# EAGLE design main (EAGLE 6.6.0)
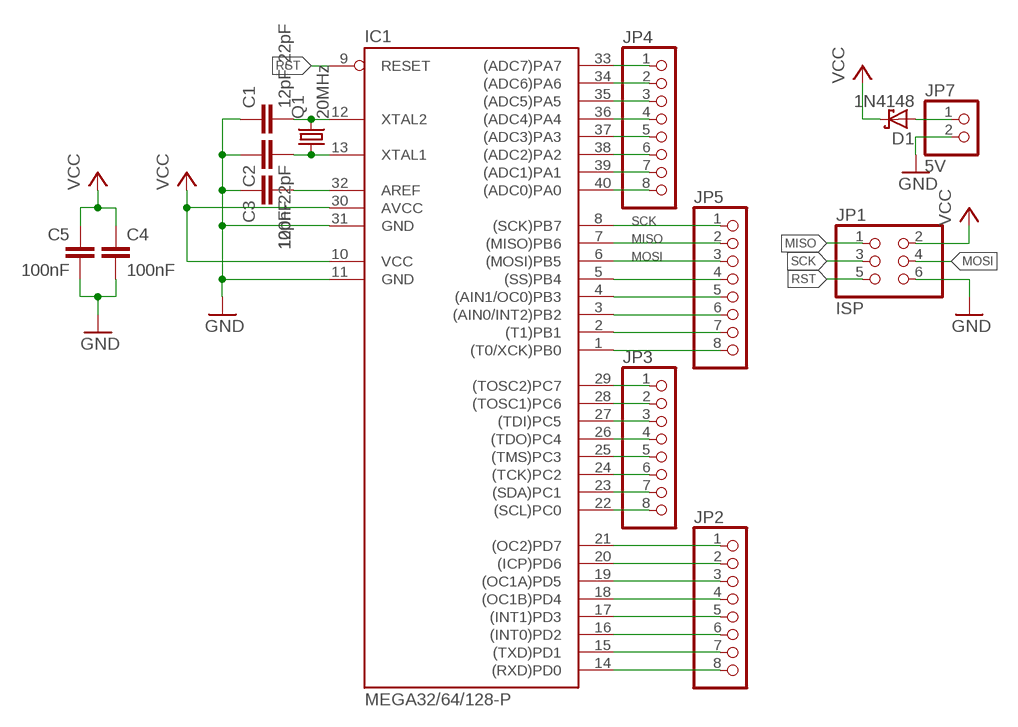
[diagram p0: schematic, sheet 1]

## Parts
C1  12pF-22pF  C-EUC0805K  [C0805K]
C2  12pF-22pF  C-EUC0805K  [C0805K]
C3  100nF  C-EUC0805K  [C0805K]
C4  100nF  C-EUC0805K  [C0805K]
C5  100nF  C-EUC0805K  [C0805K]
D1  1N4148  1N5817-B  [DO41-7.6]
IC1  MEGA32/64/128-P  MEGA32-P  [DIL40]
JP1  ISP  PINHD-2X3  [2X03]
JP2  PINHD-1X8  [1X08]
JP3  PINHD-1X8  [1X08]
JP4  PINHD-1X8  [1X08]
JP5  PINHD-1X8  [1X08]
JP7  5V  PINHD-1X2  [1X02]
Q1  20MHz  CSM-7X-DU  [CSM-7X-DU]

## Nets
GND: C1.1 C2.1 C3.1 C4.2 C5.2 IC1.11(GND) IC1.31(GND) JP1.6 JP7.2
MISO: IC1.7((MISO)PB6) JP1.1 JP5.2
MOSI: IC1.6((MOSI)PB5) JP1.4 JP5.3
N$1: C2.2 IC1.13(XTAL1) Q1.1
N$2: C1.2 IC1.12(XTAL2) Q1.2
N$3: D1.A JP7.1
N$4: C3.2 IC1.32(AREF)
N$5: IC1.5((SS)PB4) JP5.4
N$6: IC1.4((AIN1/OC0)PB3) JP5.5
N$7: IC1.21((OC2)PD7) JP2.1
N$8: IC1.20((ICP)PD6) JP2.2
N$9: IC1.19((OC1A)PD5) JP2.3
N$10: IC1.18((OC1B)PD4) JP2.4
N$11: IC1.17((INT1)PD3) JP2.5
N$12: IC1.16((INT0)PD2) JP2.6
N$13: IC1.15((TXD)PD1) JP2.7
N$14: IC1.14((RXD)PD0) JP2.8
N$15: IC1.29((TOSC2)PC7) JP3.1
N$16: IC1.28((TOSC1)PC6) JP3.2
N$17: IC1.27((TDI)PC5) JP3.3
N$18: IC1.26((TDO)PC4) JP3.4
N$19: IC1.25((TMS)PC3) JP3.5
N$20: IC1.24((TCK)PC2) JP3.6
N$21: IC1.23((SDA)PC1) JP3.7
N$22: IC1.22((SCL)PC0) JP3.8
N$23: IC1.33((ADC7)PA7) JP4.1
N$24: IC1.34((ADC6)PA6) JP4.2
N$25: IC1.35((ADC5)PA5) JP4.3
N$26: IC1.36((ADC4)PA4) JP4.4
N$27: IC1.37((ADC3)PA3) JP4.5
N$28: IC1.38((ADC2)PA2) JP4.6
N$29: IC1.39((ADC1)PA1) JP4.7
N$30: IC1.40((ADC0)PA0) JP4.8
N$31: IC1.3((AIN0/INT2)PB2) JP5.6
N$32: IC1.2((T1)PB1) JP5.7
N$33: IC1.1((T0/XCK)PB0) JP5.8
RST: IC1.9(RESET) JP1.5
SCK: IC1.8((SCK)PB7) JP1.3 JP5.1
VCC: C4.1 C5.1 D1.C IC1.10(VCC) IC1.30(AVCC) JP1.2

## Library data of the parts
C1-C5 = rcl:C-EU: CAPACITOR, European symbol
D1 = diode:1N581*: 1.0A SCHOTTKY BARRIER RECTIFIER Source: http://www.diodes.com/datasheets/ds23001.pdf
IC1 = atmel:MEGA32-P: MICROCONTROLLER 32 Kbytes FLASH 2 Kbytes SRAM 1 Kbytes EEPROM USART 8-channel 10 bit ADC Source: www.atmel.com .. doc2503.pdf; MPN: ATMEGA32-16PU; OC_FARNELL: 1661729; OC_NEWARK: 51P1794
JP1 = pinhead:PINHD-2X3: PIN HEADER
JP2-JP5 = pinhead:PINHD-1X8: PIN HEADER
JP7 = pinhead:PINHD-1X2: PIN HEADER
Q1 = crystal:CSM-7X-DU: SMD CRYSTAL Source: www.ecsxtal.com .. Crystal 3.6864MHz CSM_7X_DU.PDF; OC_FARNELL: unknown; OC_NEWARK: unknown

## Board
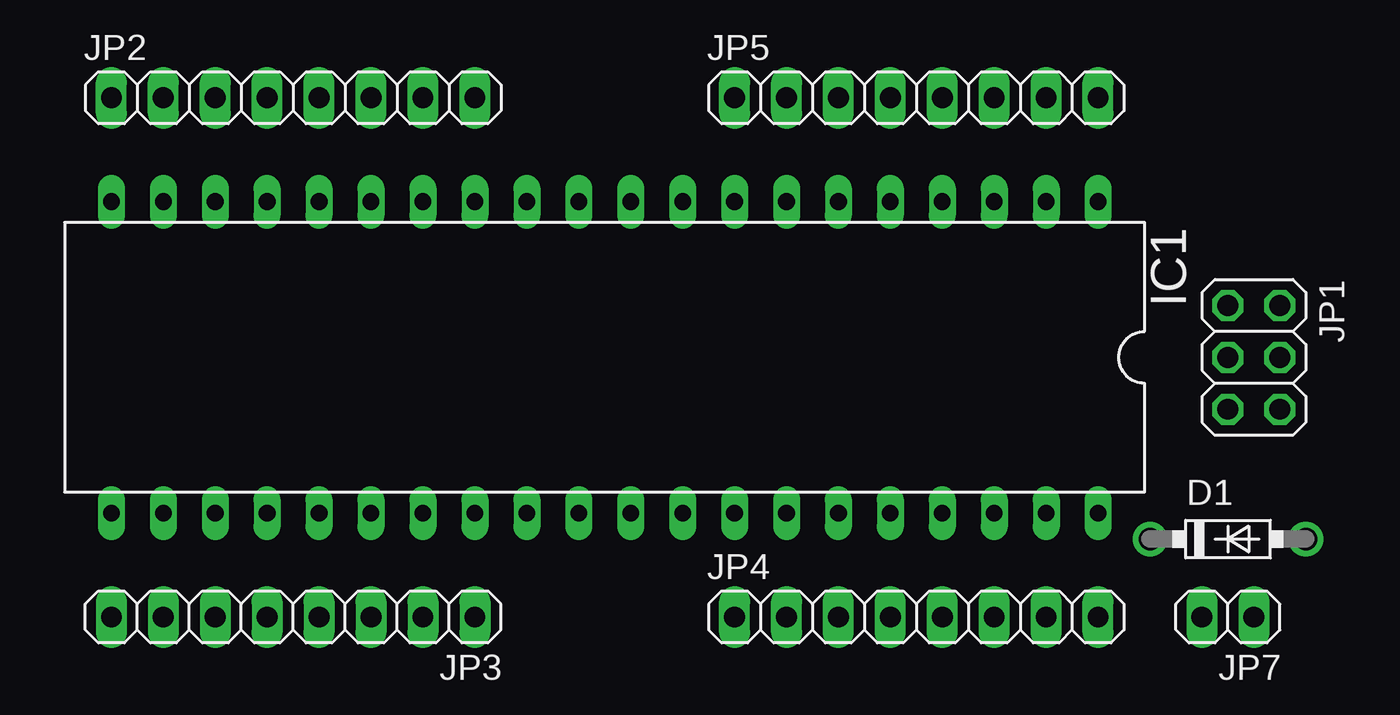
[diagram p1: board, top side]
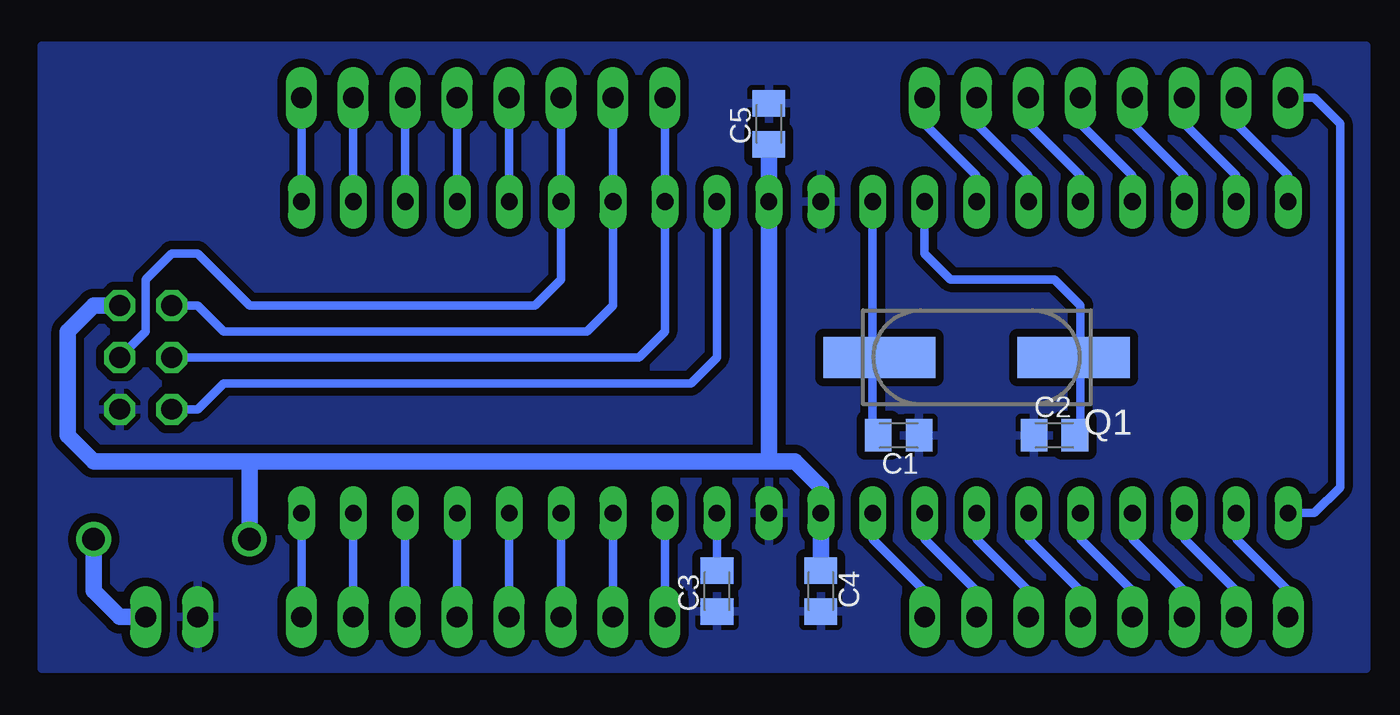
[diagram p2: board, bottom side, seen from below]

No outline drawn. Coordinates in mm, seen from the top.
Copper layers (1*16): Top 0.035mm / dielectric 1.5mm / Bottom 0.035mm
Design rules "default": minimum track width 10mil, minimum drill 24mil, track to track 8mil, track to pad 8mil, pad to pad 8mil, via to via 8mil, smd to smd 8mil, copper to edge 40mil, drill to drill 8mil, minimum pad ring 10mil, minimum via ring 8mil, stop-mask expansion 4mil, vias tented up to drill 0mil, thermal gap 10mil

### Footprints (pad centres in the part's own frame; a part is rotated, then mirrored left to right if it is on the bottom)
C0805K = smd 1.3 x 1.6: 1 -1,0; 2 1,0
DO41-7.6 = drill 1.1 pad 1.7: A 3.81,0; C -3.81,0
DIL40 = drill 0.813 long: 1 -24.13,-7.62; 2 -21.59,-7.62; 3 -19.05,-7.62; 4 -16.51,-7.62; 5 -13.97,-7.62; 6 -11.43,-7.62; 7 -8.89,-7.62; 8 -6.35,-7.62; 9 -3.81,-7.62; 10 -1.27,-7.62; 11 1.27,-7.62; 12 3.81,-7.62; 13 6.35,-7.62; 14 8.89,-7.62; 15 11.43,-7.62; 16 13.97,-7.62; 17 16.51,-7.62; 18 19.05,-7.62; 19 21.59,-7.62; 20 24.13,-7.62; 21 24.13,7.62; 22 21.59,7.62; 23 19.05,7.62; 24 16.51,7.62; 25 13.97,7.62; 26 11.43,7.62; 27 8.89,7.62; 28 6.35,7.62; 29 3.81,7.62; 30 1.27,7.62; 31 -1.27,7.62; 32 -3.81,7.62; 33 -6.35,7.62; 34 -8.89,7.62; 35 -11.43,7.62; 36 -13.97,7.62; 37 -16.51,7.62; 38 -19.05,7.62; 39 -21.59,7.62; 40 -24.13,7.62
2X03 = drill 1.016 octagon: 1 -2.54,-1.27; 2 -2.54,1.27; 3 0,-1.27; 4 0,1.27; 5 2.54,-1.27; 6 2.54,1.27
1X08 = drill 1.016 long: 1 -8.89,0; 2 -6.35,0; 3 -3.81,0; 4 -1.27,0; 5 1.27,0; 6 3.81,0; 7 6.35,0; 8 8.89,0
1X02 = drill 1.016 long: 1 -1.27,0; 2 1.27,0
CSM-7X-DU = smd 5.5 x 2: 1 -4.75,0; 2 4.75,0

### Placement (x,y rotation side)
C1  22.86,11.43 180 bottom
C2  15.24,11.43 0 bottom
C3  31.75,3.81 90 bottom
C4  26.67,3.81 270 bottom
C5  29.21,26.67 90 bottom
D1  58.42,6.35 0 top
IC1  27.94,15.24 180 top
JP1  59.69,15.24 270 top
JP2  12.7,27.94 0 top
JP3  12.7,2.54 180 top
JP4  43.18,2.54 0 top
JP5  43.18,27.94 0 top
JP7  58.42,2.54 180 top
Q1  19.05,15.24 180 bottom

### Tracks (layer width: path | path; a pad name or v marks a point on that pad's centre or on a via)
GND
  Bottom 0.406: 31.48,2.54 C3.1
  pour Bottom (isolate 0.406): 0,0 64.77,0 64.77,30.48 0,30.48
MISO
  Bottom 0.406: JP1.1 57.15,17.78 55.88,16.51 38.1,16.51 36.83,17.78 IC1.7 JP5.2
MOSI
  Bottom 0.406: JP1.4 59.69,16.51 59.69,19.05 58.42,20.32 57.15,20.32 54.61,17.78 40.64,17.78 39.37,19.05 IC1.6 JP5.3
N$1
  Bottom 0.406: IC1.13 21.59,20.32 20.32,19.05 15.24,19.05 13.97,17.78 13.97,15.24 | Q1.1 13.97,15.24 | C2.2 13.97,11.43 13.97,15.24
N$2
  Bottom 0.406: C1.2 24.13,11.43 24.13,15.24 Q1.2 24.13,15.57 IC1.12
N$3
  Bottom 0.813: JP7.1 60.96,2.54 62.23,3.81 D1.A
N$4
  Bottom 0.406: IC1.32 C3.2
N$5
  Bottom 0.406: IC1.5 JP5.4
N$6
  Bottom 0.406: JP5.5 IC1.4
N$7
  Bottom 0.406: JP2.1 2.54,27.94 1.27,26.67 1.27,8.89 2.54,7.62 IC1.21
N$8
  Bottom 0.406: JP2.2 6.35,26.67 3.81,24.13 IC1.20
N$9
  Bottom 0.406: JP2.3 8.89,26.67 6.35,24.13 IC1.19
N$10
  Bottom 0.406: JP2.4 11.43,26.67 8.89,24.13 IC1.18
N$11
  Bottom 0.406: JP2.5 13.97,26.67 11.43,24.13 IC1.17
N$12
  Bottom 0.406: IC1.16 13.97,24.13 16.51,26.67 JP2.6
N$13
  Bottom 0.406: IC1.15 16.51,24.13 19.05,26.67 JP2.7
N$14
  Bottom 0.406: IC1.14 19.05,24.13 21.59,26.67 JP2.8
N$15
  Bottom 0.406: IC1.29 24.13,6.35 21.59,3.81 JP3.1
N$16
  Bottom 0.406: IC1.28 21.59,6.35 19.05,3.81 JP3.2
N$17
  Bottom 0.406: IC1.27 19.05,6.35 16.51,3.81 JP3.3
N$18
  Bottom 0.406: IC1.26 16.51,6.35 13.97,3.81 JP3.4
N$19
  Bottom 0.406: IC1.25 13.97,6.35 11.43,3.81 JP3.5
N$20
  Bottom 0.406: IC1.24 11.43,6.35 8.89,3.81 JP3.6
N$21
  Bottom 0.406: IC1.23 8.89,6.35 6.35,3.81 JP3.7
N$22
  Bottom 0.406: IC1.22 6.35,6.35 3.81,3.81 JP3.8
N$23
  Bottom 0.406: IC1.33 JP4.1
N$24
  Bottom 0.406: IC1.34 JP4.2
N$25
  Bottom 0.406: IC1.35 JP4.3
N$26
  Bottom 0.406: IC1.36 JP4.4
N$27
  Bottom 0.406: IC1.37 JP4.5
N$28
  Bottom 0.406: IC1.38 JP4.6
N$29
  Bottom 0.406: IC1.39 JP4.7
N$30
  Bottom 0.406: IC1.40 JP4.8
N$31
  Bottom 0.406: JP5.6 IC1.3
N$32
  Bottom 0.406: JP5.7 IC1.2
N$33
  Bottom 0.406: JP5.8 IC1.1
RST
  Bottom 0.406: IC1.9 31.75,15.24 33.02,13.97 55.88,13.97 57.15,12.7 JP1.5
SCK
  Bottom 0.406: JP1.3 35.56,15.24 34.29,16.51 IC1.8 JP5.1
VCC
  Bottom 0.406: C5.1 29.21,25.4
  Bottom 0.813: JP1.2 62.23,17.78 63.5,16.51 63.5,11.43 62.23,10.16 54.61,10.16 | 29.21,25.4 IC1.10 29.21,10.16 | C4.1 IC1.30 26.67,8.89 27.94,10.16 29.21,10.16 | 29.21,10.16 54.61,10.16 | 54.61,10.16 D1.C 54.61,10.16